# Altium schematic sheet Signal IO.SchDoc
size A; SheetNumber: 2; SheetTotal: 2
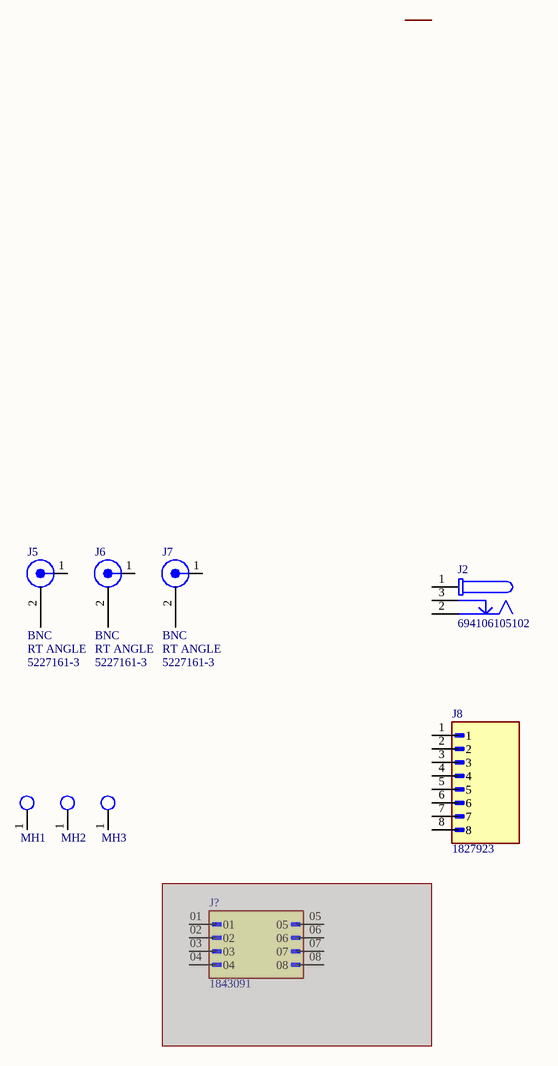
[diagram p0: Signal IO.SchDoc]

## Parts
J2  694106105102  [694106105102]
J5  BNC  value RT ANGLE  Manf P/N: 5227161-3  [URF/BNC/R1.350/FIXED]
J6  BNC  value RT ANGLE  Manf P/N: 5227161-3  [URF/BNC/R1.350/FIXED]
J7  BNC  value RT ANGLE  Manf P/N: 5227161-3  [URF/BNC/R1.350/FIXED]
J8  1827923  [PHOENIX_1827923]
J?  1843091  [PHOENIX_1843091]  (masked out: inside a compile mask, not in the netlist)
MH1  HOLE_128  [HOLE_128]  (value not drawn)  (no BOM)
MH2  HOLE_128  [HOLE_128]  (value not drawn)  (no BOM)
MH3  HOLE_128  [HOLE_128]  (value not drawn)  (no BOM)

## Nets

Not connected (* = marked no-connect by the designer): J2 1 2 3; J5 1(CENTER) 2(SHIELD); J6 1(CENTER) 2(SHIELD); J7 1(CENTER) 2(SHIELD); J8 1 2 3 4 5 6 7 8; MH1 1; MH2 1; MH3 1

## Library data of the parts
J2 = CMP-1502-00176-2: NexarPartId: 52645183; Insulation Resistance: 100MΩ; Operating Supply Voltage: 24V; Shielding: Unshielded; Gender: Male; Current Rating: 5A; Number of Contacts: 3; Connector Type: Power; Color: Black; Contact Plating: Tin; Min Operating Temperature: -40°C; Flammability Rating: UL94 V-0; Voltage Rating: 24V; Voltage Rating (DC): 24V; Contact Material: Gold; Contact Gender: Female; Packaging: Tape and Reel; Mount: Surface Mount; Height: 11.2mm; Housing Material: Polyamide; REACH SVHC: Unknown; Max Operating Temperature: 85°C; RoHS: Compliant; Termination: SMD/SMT
J5-J7 = 1-00233: BNC, PCB Panel Mount, Right Angle, Isolated; Manf: TYCO; Cat1: Thru-hole; Cat2: Coax; Part Number: 1-00233; Type: Connector\Thru-hole\Coax\BNC; ComponentLink2URL: http://srsdata.corp.thinksrs.com:3838/ShinyParts/?Detail=100233; ComponentLink1URL: http://ventura.corp.thinksrs.com/datasheets/100233/datasheet.pdf; ComponentLink2Description: Info; ComponentLink1Description: datasheet; Cat3: BNC
J8 = 1827923: Pluggable Header 3.81mm 16AWG 160V 8A 8 Position COMBICON MC Series | Phoenix Contact 1827923; SnapEDA_Link: https://www.snapeda.com/parts/1827923/Phoenix+Contact/view-part/?ref=snap; Package: None; Value: *; MF: Phoenix Contact; MP: 1827923; Check_prices: https://www.snapeda.com/parts/1827923/Phoenix+Contact/view-part/?ref=eda
J? = 1843091: MF: {'manufacturer': u'Phoenix Contact'}; Package: None; Price: None; Value: *; MP: 1843091; Availability: Unavailable
MH1-MH3 = HOLE_128: 0.128 mounting hole, clearance for 4-40